# EAGLE schematic X15_PowerPlate.sch (EAGLE 9.7.0)

## Sheet 1 of 3: BRICKS SHEET
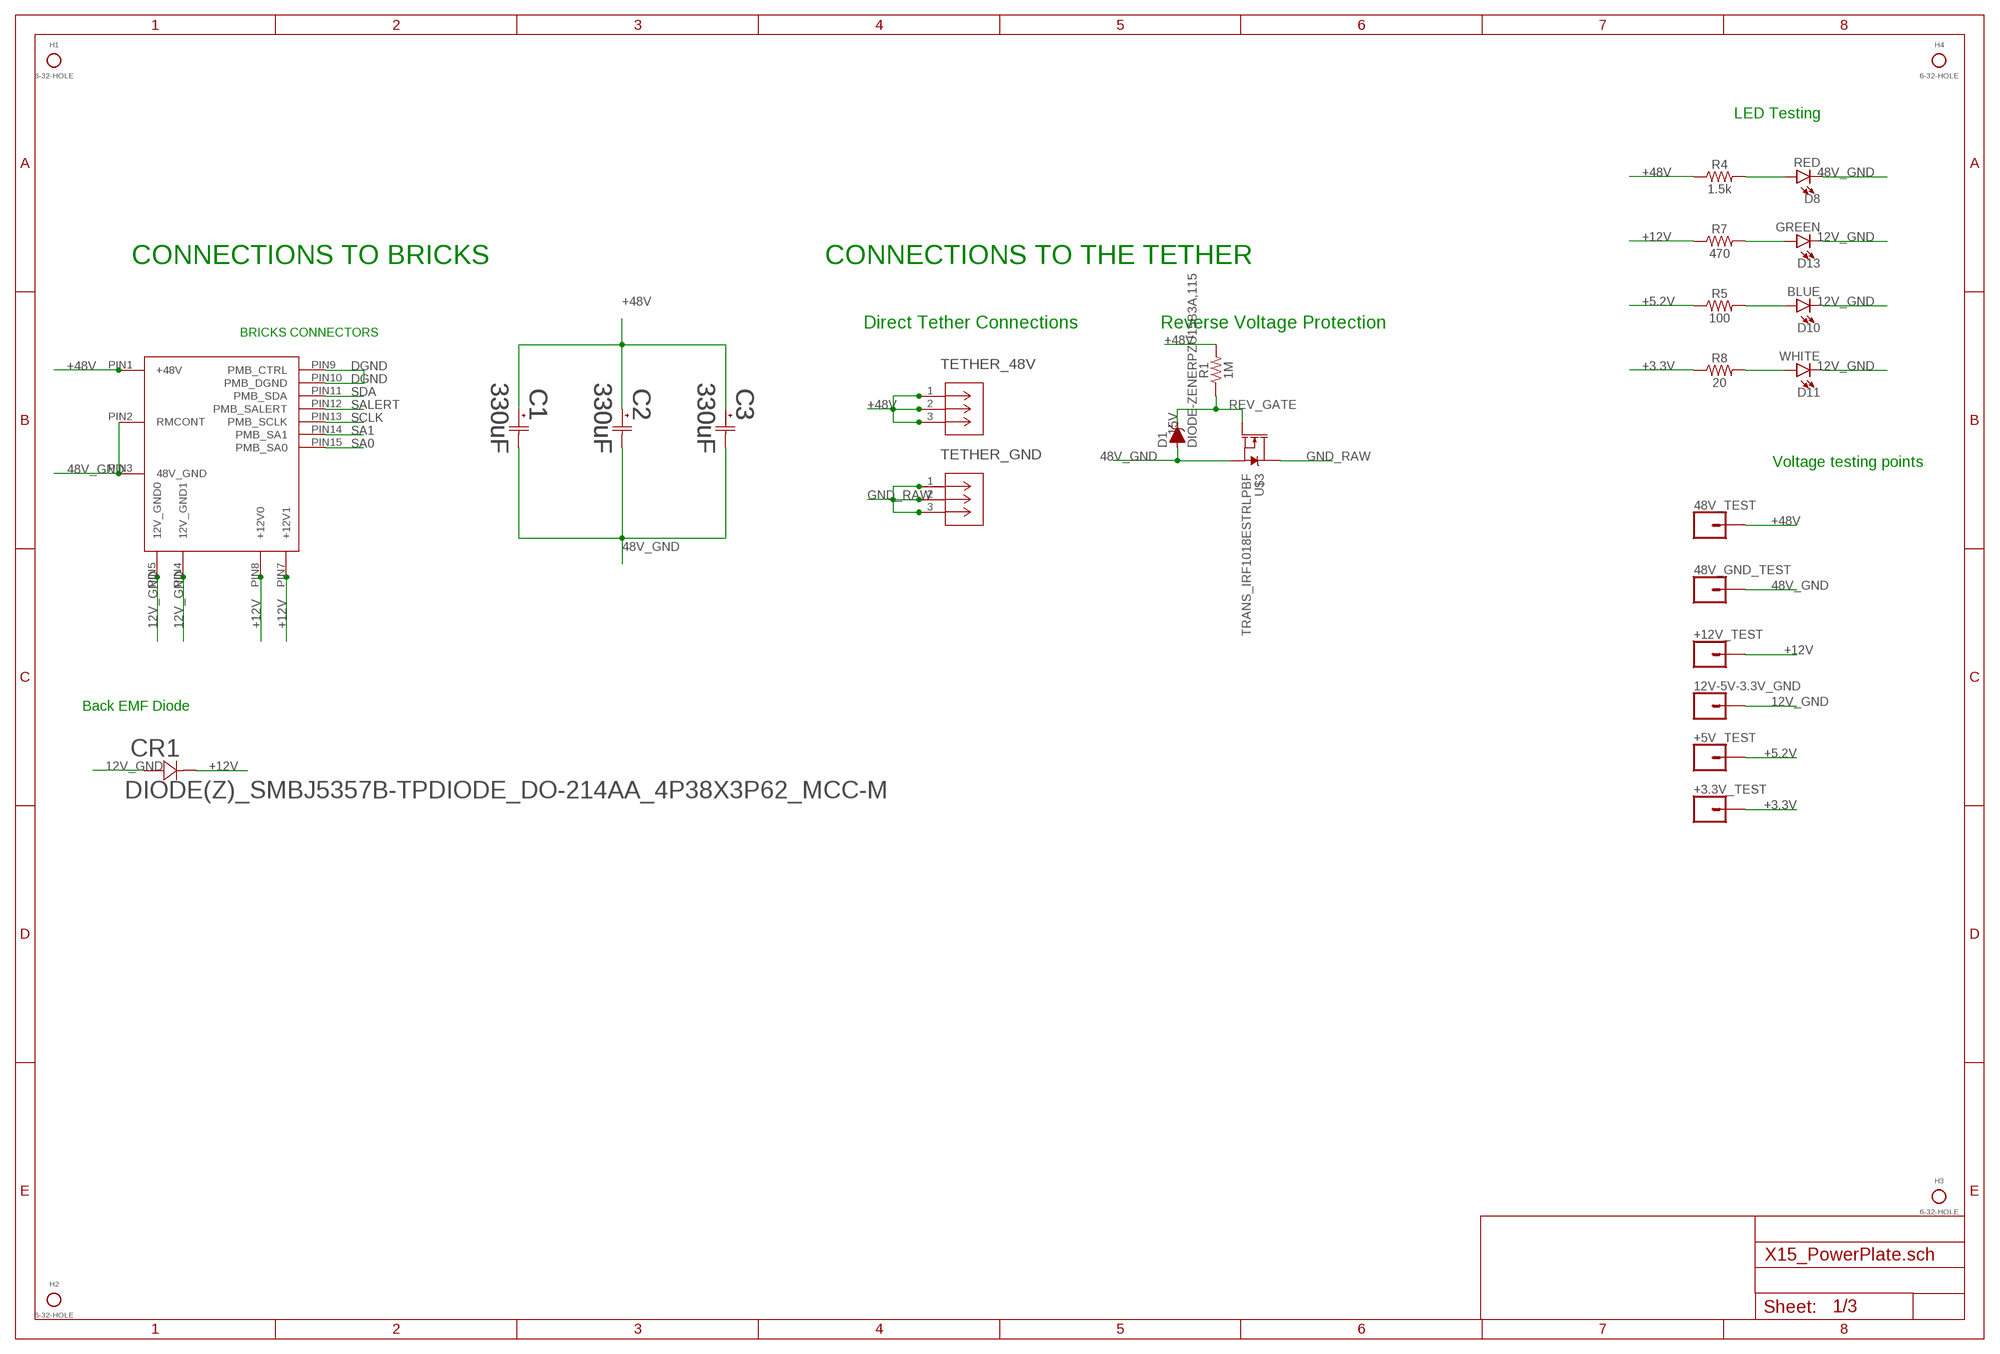
[diagram p0: schematic, sheet 1]

### Parts
12V-5V-3.3V_GND  CONN_01  [1X01]
48V_GND_TEST  CONN_01  [1X01]
48V_TEST  CONN_01  [1X01]
+3.3V_TEST  CONN_01  [1X01]
+5V_TEST  CONN_01  [1X01]
+12V_TEST  CONN_01  [1X01]
C1  330uF  CAP_MAL215099112E3CAP_099112E3_VIS-M  [CAP_099112E3_VIS-M]
C2  330uF  CAP_MAL215099112E3CAP_099112E3_VIS-M  [CAP_099112E3_VIS-M]
C3  330uF  CAP_MAL215099112E3CAP_099112E3_VIS-M  [CAP_099112E3_VIS-M]
CR1  DIODE(Z)_SMBJ5357B-TPDIODE_DO-214AA_4P38X3P62_MCC-M  [DIODE_DO-214AA_4P38X3P62_MCC-M]
D1  DIODE-ZENERPZU15B3A,115  [SOD-323]
D8  RED  LED-RED0603  [LED-0603]
D10  BLUE  LED-BLUE0603  [LED-0603]
D11  WHITE  LED-WHITE0603  [LED-0603]
D13  GREEN  LED-GREEN0603  [LED-0603]
H1  6-32-HOLE  [6-32-HOLE]
H2  6-32-HOLE  [6-32-HOLE]
H3  6-32-HOLE  [6-32-HOLE]
H4  6-32-HOLE  [6-32-HOLE]
R1  1M  1MOHM-0603-1/4W-5%  [0603]
R4  1.5k  1.5KOHM-0603-1/10W-1%  [0603]
R5  100  100OHM-0603-1/4W-5%  [0603]
R7  470  470OHM-0603-1/10W-1%  [0603]
R8  20  20OHM-0603-1/10W-1%  [0603]
TETHER_48V  796636-3(TETHER)  [CON3_P5MM_VER_TERM-BLK_TYC]
TETHER_GND  796636-3(TETHER)  [CON3_P5MM_VER_TERM-BLK_TYC]
U$2  CONN_BMR480_CONNECTOR(BRICK)  [BMR480_CONNECTOR]
U$3  TRANS_IRF1018ESTRLPBF  TRANS_IRF1018EPBF  [D2PAK]

### Nets
12V_GND: 12V-5V-3.3V_GND.1 CR1.2 D10.C D11.C D13.C U$2.PIN4(12V_GND1) U$2.PIN5(12V_GND0) ; also sheet 2,3
48V_GND: 48V_GND_TEST.1 C1.2 C2.2 C3.2 D1.A D8.C U$2.PIN2(RMCONT) U$2.PIN3(48V_GND) U$3.2(S)
+3.3V: +3.3V_TEST.1 R8.1 ; also sheet 2,3
+5.2V: +5V_TEST.1 R5.1 ; also sheet 2,3
+12V: +12V_TEST.1 CR1.1 R7.1 U$2.PIN7(+12V1) U$2.PIN8(+12V0) ; also sheet 2,3
+48V: 48V_TEST.1 C1.1 C2.1 C3.1 R1.2 R4.1 TETHER_48V.1 TETHER_48V.2 TETHER_48V.3 U$2.PIN1(+48V)
DGND: U$2.PIN9(PMB_CTRL) U$2.PIN10(PMB_DGND)
GND_RAW: TETHER_GND.1 TETHER_GND.2 TETHER_GND.3 U$3.3(D)
N$4: D8.A R4.2
N$9: D10.A R5.2
N$10: D11.A R8.2
N$13: D13.A R7.2
REV_GATE: D1.C R1.1 U$3.1(G)
SA0: U$2.PIN15(PMB_SA0)
SA1: U$2.PIN14(PMB_SA1)
SALERT: U$2.PIN12(PMB_SALERT)
SCLK: U$2.PIN13(PMB_SCLK)
SDA: U$2.PIN11(PMB_SDA)

### Notes on the sheet
- LED Testing
- CONNECTIONS TO BRICKS | CONNECTIONS TO THE TETHER
- Direct Tether Connections | Reverse Voltage Protection
- BRICKS CONNECTORS
- Voltage testing points
- Back EMF Diode

## Sheet 2 of 3: BACKPLANE SHEET
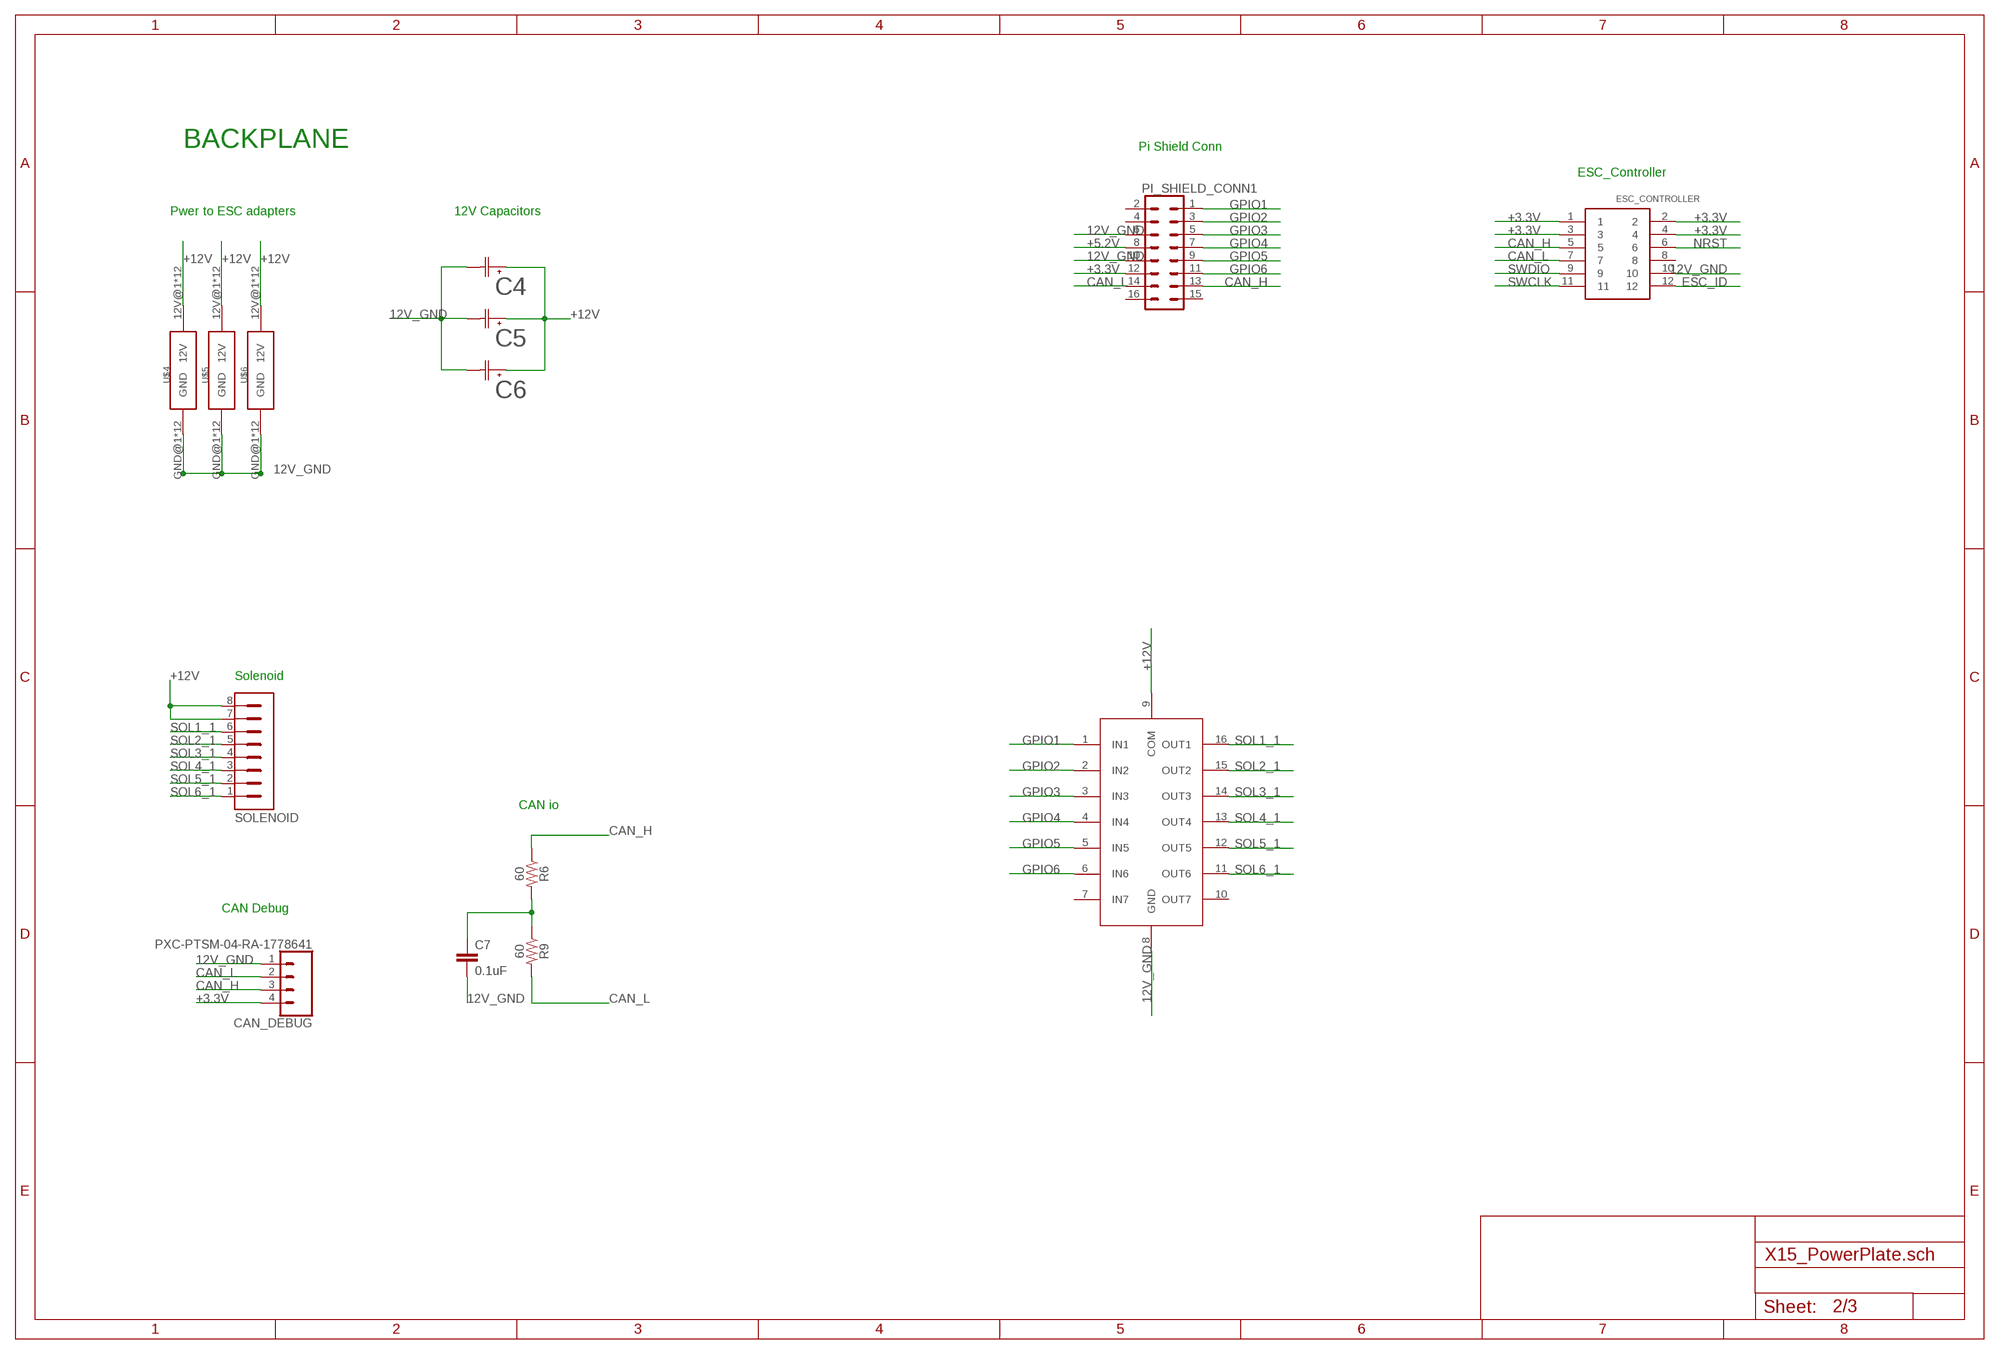
[diagram p1: schematic, sheet 2]

### Parts
C4  UCV1E561MNL1GSCAP_UCD_8X10_NCH  [CAP_UCD_8X10_NCH]
C5  UCV1E561MNL1GSCAP_UCD_8X10_NCH  [CAP_UCD_8X10_NCH]
C6  UCV1E561MNL1GSCAP_UCD_8X10_NCH  [CAP_UCD_8X10_NCH]
C7  0.1uF  0.1UF-0603-100V-10%  [0603]
CAN_DEBUG  PXC-PTSM-04-RA-1778641  [PXC-PTSM-04-RA-1778641]
ESC_CONTROLLER  BACKPLANE_CONNECTORSBKP  [BACKPLANE_CONNECTORS_BKP]
PI_SHIELD_CONN1  8X_CONN  [IPL7X2]
R6  60  RESISTOR0603  [0603]
R9  60  RESISTOR0603  [0603]
SOLENOID  PXC-8-RA-1778683  [PXC-8-RA-1778683]
U2  ULN2003AD  [16-SOIC]
U$4  BACKPLANE_ESC_ADAPTER_PWRBKP  [BACKPLANE_ESC_ADAPTER_BKP_PWR]
U$5  BACKPLANE_ESC_ADAPTER_PWRBKP  [BACKPLANE_ESC_ADAPTER_BKP_PWR]
U$6  BACKPLANE_ESC_ADAPTER_PWRBKP  [BACKPLANE_ESC_ADAPTER_BKP_PWR]

### Nets
12V_GND: C4.2 C5.2 C6.2 C7.2 CAN_DEBUG.1 ESC_CONTROLLER.10 PI_SHIELD_CONN1.6 PI_SHIELD_CONN1.10 U2.8(GND) U$4.GND@1(GND) U$4.GND@2(GND) U$4.GND@3(GND) U$4.GND@4(GND) U$4.GND@5(GND) U$4.GND@6(GND) U$4.GND@7(GND) U$4.GND@8(GND) U$4.GND@9(GND) U$4.GND@10(GND) U$4.GND@11(GND) U$4.GND@12(GND) U$5.GND@1(GND) U$5.GND@2(GND) U$5.GND@3(GND) U$5.GND@4(GND) U$5.GND@5(GND) U$5.GND@6(GND) U$5.GND@7(GND) U$5.GND@8(GND) U$5.GND@9(GND) U$5.GND@10(GND) U$5.GND@11(GND) U$5.GND@12(GND) U$6.GND@1(GND) U$6.GND@2(GND) U$6.GND@3(GND) U$6.GND@4(GND) U$6.GND@5(GND) U$6.GND@6(GND) U$6.GND@7(GND) U$6.GND@8(GND) U$6.GND@9(GND) U$6.GND@10(GND) U$6.GND@11(GND) U$6.GND@12(GND) ; also sheet 1,3
+3.3V: CAN_DEBUG.4 ESC_CONTROLLER.1 ESC_CONTROLLER.2 ESC_CONTROLLER.3 ESC_CONTROLLER.4 PI_SHIELD_CONN1.12 ; also sheet 1,3
+5.2V: PI_SHIELD_CONN1.8 ; also sheet 1,3
+12V: C4.1 C5.1 C6.1 SOLENOID.7 SOLENOID.8 U2.9(COM) U$4.12V@1(12V) U$4.12V@2(12V) U$4.12V@3(12V) U$4.12V@4(12V) U$4.12V@5(12V) U$4.12V@6(12V) U$4.12V@7(12V) U$4.12V@8(12V) U$4.12V@9(12V) U$4.12V@10(12V) U$4.12V@11(12V) U$4.12V@12(12V) U$5.12V@1(12V) U$5.12V@2(12V) U$5.12V@3(12V) U$5.12V@4(12V) U$5.12V@5(12V) U$5.12V@6(12V) U$5.12V@7(12V) U$5.12V@8(12V) U$5.12V@9(12V) U$5.12V@10(12V) U$5.12V@11(12V) U$5.12V@12(12V) U$6.12V@1(12V) U$6.12V@2(12V) U$6.12V@3(12V) U$6.12V@4(12V) U$6.12V@5(12V) U$6.12V@6(12V) U$6.12V@7(12V) U$6.12V@8(12V) U$6.12V@9(12V) U$6.12V@10(12V) U$6.12V@11(12V) U$6.12V@12(12V) ; also sheet 1,3
CAN_H: CAN_DEBUG.3 ESC_CONTROLLER.5 PI_SHIELD_CONN1.13 R6.1
CAN_L: CAN_DEBUG.2 ESC_CONTROLLER.7 PI_SHIELD_CONN1.14 R9.2
ESC_ID: ESC_CONTROLLER.12
GPIO1: PI_SHIELD_CONN1.1 U2.1(IN1)
GPIO2: PI_SHIELD_CONN1.3 U2.2(IN2)
GPIO3: PI_SHIELD_CONN1.5 U2.3(IN3)
GPIO4: PI_SHIELD_CONN1.7 U2.4(IN4)
GPIO5: PI_SHIELD_CONN1.9 U2.5(IN5)
GPIO6: PI_SHIELD_CONN1.11 U2.6(IN6)
N$1: C7.1 R6.2 R9.1
NRST: ESC_CONTROLLER.6
SOL1_1: SOLENOID.6 U2.16(OUT1)
SOL2_1: SOLENOID.5 U2.15(OUT2)
SOL3_1: SOLENOID.4 U2.14(OUT3)
SOL4_1: SOLENOID.3 U2.13(OUT4)
SOL5_1: SOLENOID.2 U2.12(OUT5)
SOL6_1: SOLENOID.1 U2.11(OUT6)
SWCLK: ESC_CONTROLLER.11
SWDIO: ESC_CONTROLLER.9
Unconnected: ESC_CONTROLLER.8 PI_SHIELD_CONN1.2 PI_SHIELD_CONN1.4 PI_SHIELD_CONN1.15 PI_SHIELD_CONN1.16 U2.7(IN7) U2.10(OUT7)

### Notes on the sheet
- BACKPLANE | Pi Shield Conn
- ESC_Controller
- Pwer to ESC adapters | 12V Capacitors
- Solenoid
- CAN io
- CAN Debug

## Sheet 3 of 3: POWER CONVERSION
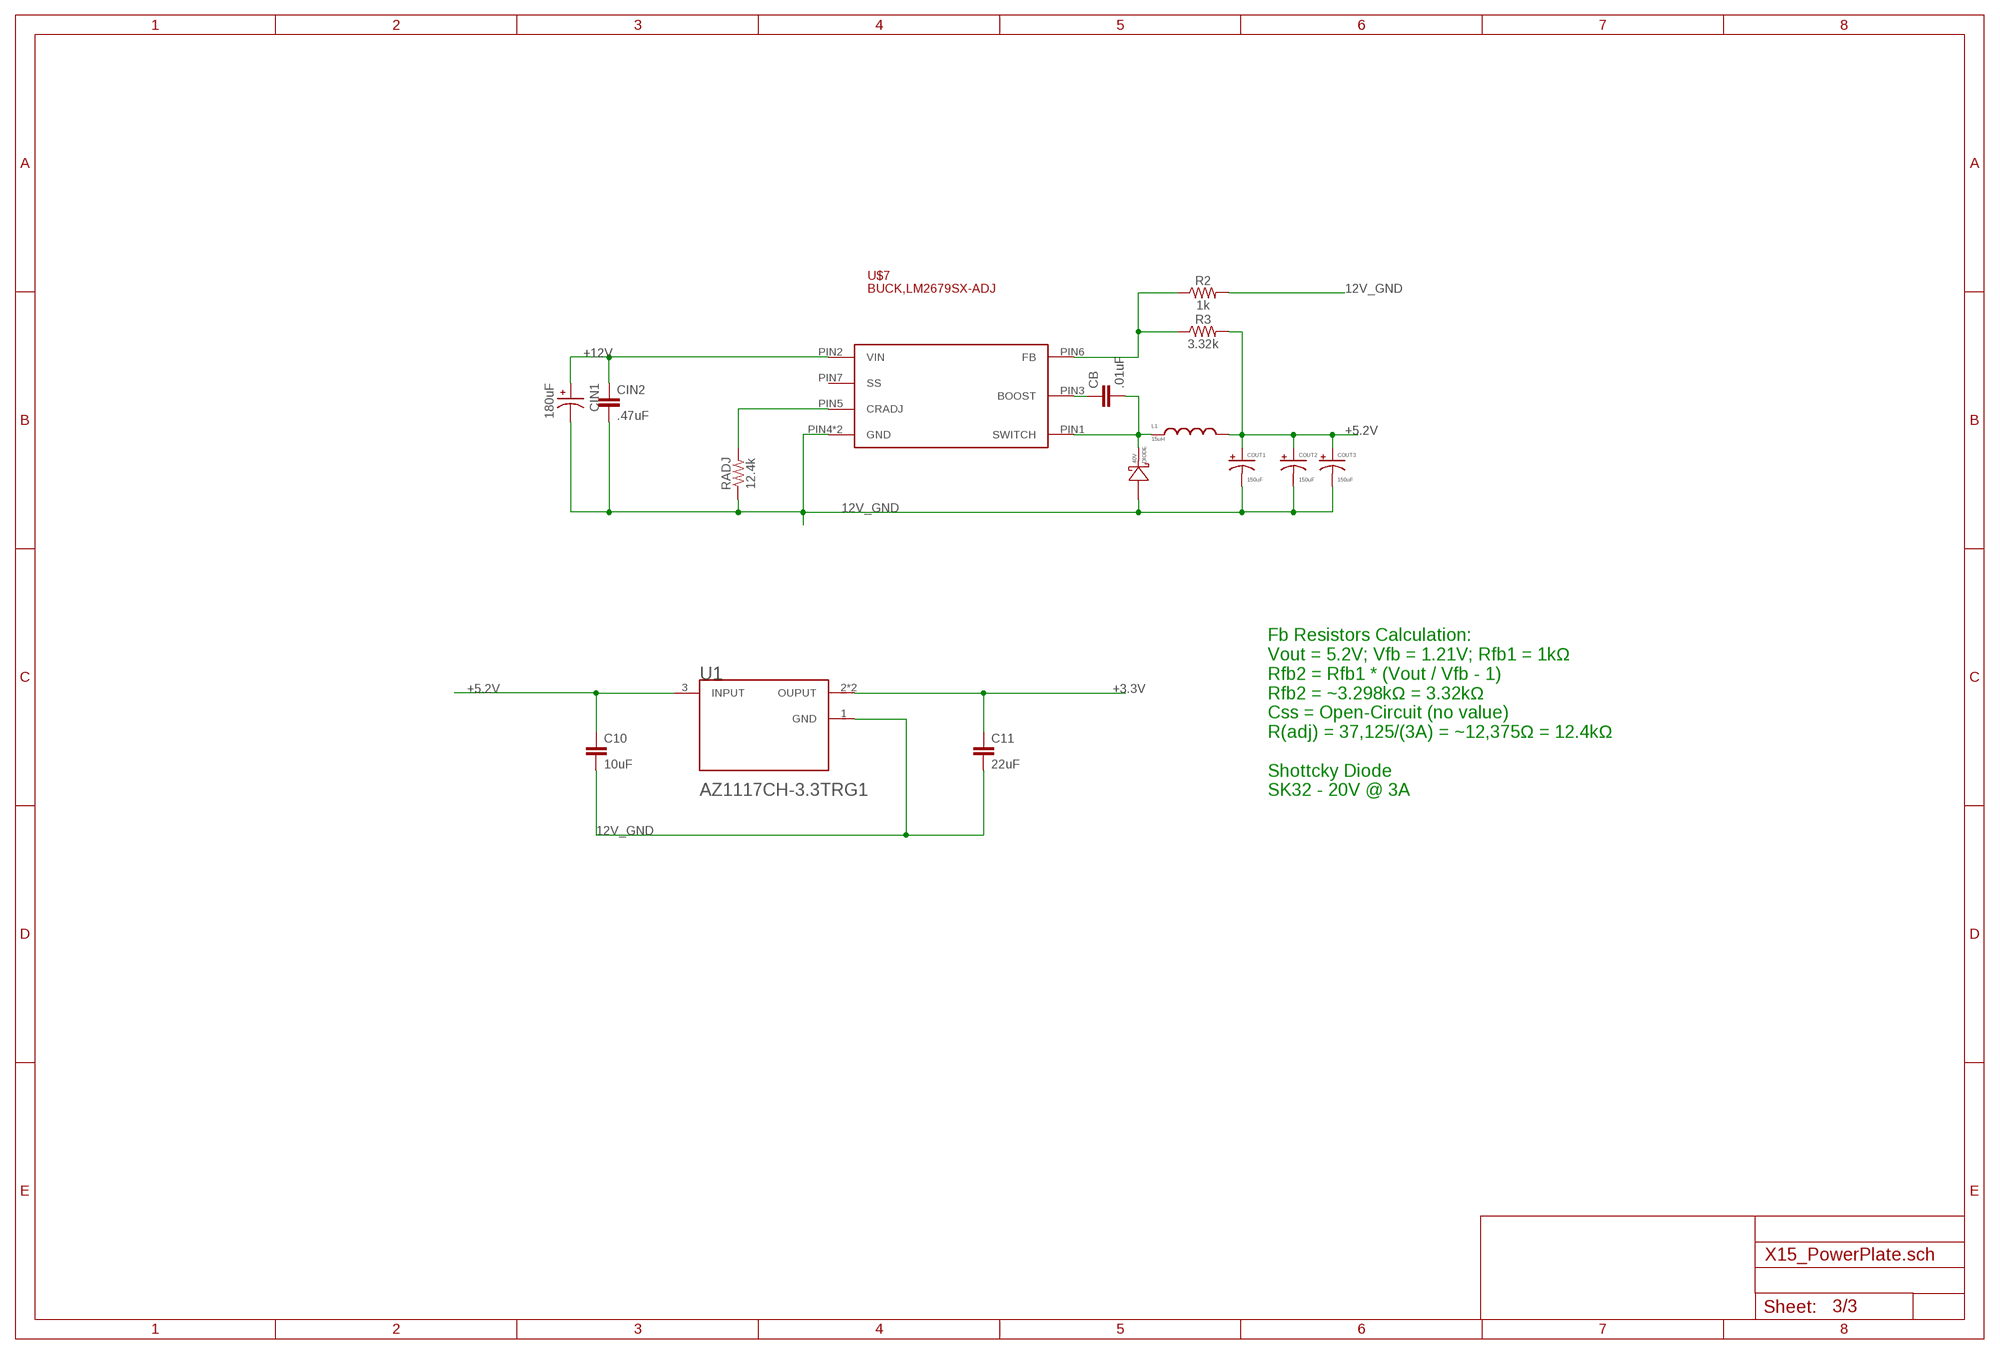
[diagram p2: schematic, sheet 3]

### Parts
C10  10uF  4.7PF-0603-50V-5%  [0603]
C11  22uF  4.7PF-0603-50V-5%  [0603]
CB  .01uF  4.7PF-0603-50V-5%  [0603]
CIN1  180uF  EEEFKE181XSP  [CAP_EEEFKE181XSP]
CIN2  .47uF  4.7PF-0603-50V-5%  [0603]
COUT1  150uF  C-TANTALUM(10UF_150UF)  [2917(7343-31-METRIC)]
COUT2  150uF  C-TANTALUM(10UF_150UF)  [2917(7343-31-METRIC)]
COUT3  150uF  C-TANTALUM(10UF_150UF)  [2917(7343-31-METRIC)]
DIODE  40V  CDBG520-G  [DO214AC]
L1  15uH  HCMA1305  [HCMA1305]
R2  1k  2.0KOHM-0603-1/10W-5%  [0603]
R3  3.32k  2.0KOHM-0603-1/10W-5%  [0603]
RADJ  12.4k  2.0KOHM-0603-1/10W-5%  [0603]
U1  LINEAR,AZ1117CR-3.3TRG1DIODES_AZ1117CH-3.3TRG1_0_0  [LINEAR,AZ1117CR-3.3TRG1]
U$7  BUCK,LM2679SX-ADJ  [BUCK,LM2679SX-ADJ]

### Nets
12V_GND: C10.2 C11.2 CIN1.2 CIN2.2 COUT1.- COUT2.- COUT3.- DIODE.A R2.2 RADJ.1 U1.1(GND) U$7.PIN4(GND) U$7.PIN8(GND) ; also sheet 1,2
+3.3V: C11.1 U1.2(OUPUT) U1.4(OUPUT) ; also sheet 1,2
+5.2V: C10.1 COUT1.+ COUT2.+ COUT3.+ L1.2 R3.2 U1.3(INPUT) ; also sheet 1,2
+12V: CIN1.1 CIN2.1 U$7.PIN2(VIN) ; also sheet 1,2
BOOST: CB.1 U$7.PIN3(BOOST)
CRADJ: RADJ.2 U$7.PIN5(CRADJ)
FB: R2.1 R3.1 U$7.PIN6(FB)
SWITCH: CB.2 DIODE.C L1.1 U$7.PIN1(SWITCH)
Unconnected: U$7.PIN7(SS)

### Notes on the sheet
- Fb Resistors Calculation: 
  Vout = 5.2V; Vfb = 1.21V; Rfb1 = 1kΩ 
  Rfb2 = Rfb1 * (Vout / Vfb - 1) 
  Rfb2 = ~3.298kΩ = 3.32kΩ
  Css = Open-Circuit (no value)
  R(adj) = 37,125/(3A) = ~12,375Ω = 12.4kΩ
  
  Shottcky Diode
  SK32 - 20V @ 3A

## Library data of the parts
12V-5V-3.3V_GND 48V_GND_TEST 48V_TEST +3.3V_TEST +5V_TEST +12V_TEST = SparkFun-Connectors:CONN_01: Single connection point. Often used as Generic Header-pin footprint for 0.1 inch spaced/style header connections On any of the 0.1 inch spaced packages, you can populate with these: Break Away Headers - Straight <https://www.sparkfun.com/products/116> (PRT-00116) Break Away Male Headers - Right Angle <https://www.sparkfun.com/products/553> (PRT-00553) Female Headers <https://www.sparkfun.com/products/115> (PRT-00115) Break Away Headers - Machine Pin <https://www.sparkfun.com/products/117> (PRT-00117) Break Away Female Headers - Swiss Machine Pin <https://www.sparkfun.com/products/743> (PRT-00743) This device is also useful as a general connection point to wire up your design to another part of your project. Our various solder wires solder well into these plated through hole pads. Hook-Up Wire - Assortment (Stranded, 22 AWG) <https://www.sparkfun.com/products/11375> (PRT-11375) Hook-Up Wire - Assortment (Solid Core, 22 AWG) <https://www.sparkfun.com/products/11367> (PRT-11367) View the entire wire category on our website here <https://www.sparkfun.com/categories/141> Special notes: SMTSO-256-ET is a "flush mount" nut for a 4-40 screw. We mostly use this on specialty testbeds; it is a nice way to connect hardware to your PCB at an adjustable hieght. Also note, the SNAP packages are for using a snappable style connector. We sell a baggie of snaps and they are also used on two LilyPad designs: Snap Assortment - 30 pack (male and female) <https://www.sparkfun.com/products/11347> (DEV-11347) LilyPad Arduino SimpleSnap <https://www.sparkfun.com/products/10941> (DEV-10941) LilyPad SimpleSnap Protoboard <https://www.sparkfun.com/products/10940> (DEV-10940)
C1-C3 = X15_Brickstribution:CAP_MAL215099112E3; COPYRIGHT: Copyright (C) 2022 Ultra Librarian. All rights reserved.; MANUFACTURER_PART_NUMBER: MAL215099112E3; MFR_NAME: Vishay
C4-C6 = 2023-01-03_19-29-37_Library:UCV1E561MNL1GS; COPYRIGHT: Copyright (C) 2023 Ultra Librarian. All rights reserved.; DIGI-KEY_PART_NUMBER_1: 493-14353-1-ND; DIGI-KEY_PART_NUMBER_2: 493-14353-2-ND; DIGI-KEY_PART_NUMBER_3: 493-14353-6-ND; MANUFACTURER_PART_NUMBER: UCV1E561MNL1GS; MFR_NAME: Nichicon
C7 = SparkFun-Capacitors:0.1UF: 0.1µF ceramic capacitors A capacitor is a passive two-terminal electrical component used to store electrical energy temporarily in an electric field.; PROD_ID: CAP-08390
C10 C11 CB CIN2 = SparkFun-Capacitors:4.7PF: 4.7pF ceramic capacitors A capacitor is a passive two-terminal electrical component used to store electrical energy temporarily in an electric field.; PROD_ID: CAP-07880; VALUE: 4.7pF
CAN_DEBUG = X15-Backplane Parts:PXC-PTSM-04-RA-1778641
CIN1 = X15-Conversion-Parts-Library:EEEFKE181XSP; DESCRIPTION: 180µF 25V Aluminum Electrolytic Capacitors Radial, Can - SMD 340mOhm @ 100kHz 2000 Hrs @ 105°C; DIGI-KEY_PART_NUMBER: P18956TR-ND; MF: Panasonic; MP: EEEFKE181XSP; PACKAGE: RADIAL-2 Panasonic
COUT1-COUT3 = X15-Conversion-Parts-Library:C-TANTALUM(10UF_150UF)
CR1 = X15_Brickstribution:DIODE(Z)_SMBJ5357B-TP; COPYRIGHT: Copyright (C) 2022 Ultra Librarian. All rights reserved.; MANUFACTURER_PART_NUMBER: SMBJ5357B-TP; MFR_NAME: MCC
D1 = SparkFun-DiscreteSemi:DIODE-ZENER: Zener Diode A Zener diode allows current to flow from its anode to its cathode like a normal semiconductor diode, but it also permits current to flow in the reverse direction when its "Zener voltage" is reached. - WIkipedia; ZENER_VOLTAGE: 15V
D8 = SparkFun-LED:LED-RED: Red SMD LED Used in manufacturing of most products at SparkFun Packages: 0603 - SMD 0603 package [Product Link] <http://docs.avagotech.com/docs/AV02-0551EN> 0603 SMART - SMD 0603 SMART package ( more efficient and expensive)[Product Link] <http://www.osram-os.com/Graphics/XPic2/00077099_0.pdf> 1206 - SMD1206 package [Product Link] <https://www.sparkfun.com/datasheets/DevTools/LilyPad/Q150OVS4.pdff> SparkFun Products: Pro Mini 328 -5V <https://www.sparkfun.com/products/821> RedBoard <https://www.sparkfun.com/products/12757> IOIO-OTG <https://www.sparkfun.com/products/13613>; PROD_ID: DIO-00819
D10 = SparkFun-LED:LED-BLUE: Blue SMD LED Used in manufacturing of various products at SparkFun Packages: 0603 - SMD 0603 package [Product Link] <http://www.digikey.com/product-detail/en/SMLE12BC7TT86/511-1589-2-ND/1641808> 1206 - SMD1206 package [Product Link] <http://www.digikey.com/product-detail/en/lite-on-inc/LTST-C150TBKT/160-1643-1-ND/573584> SparkFun Products: ESP8266 Thing-Dev Board <https://www.sparkfun.com/products/13711> RedBoard <https://www.sparkfun.com/products/12757>; PROD_ID: DIO-08575
D11 = SparkFun-LED:LED-WHITE: White SMD LED Used in manufacturing several products at SparkFun. Packages: 0603 - Bright White SMD 0603 package[Product Link] <http://www.kingbrightusa.com/product.asp?catalog_name=LED&product_id=APT1608QWF/D> 1206 - Bright White SMD1206 package [Product Link] <http://www.kingbrightusa.com/product.asp?catalog_name=LED&product_id=APT3216QWF/D> 3014 - Super Bright SMD 3014 package [Datasheet] <http://www.lumileds.com/uploads/459/DS208-pdf> SparkFun Products: Blackberry Trackballer Breakout <https://www.sparkfun.com/products/13169> Digital SandBox <https://www.sparkfun.com/products/12651>; PROD_ID: DIO-09004
D13 = SparkFun-LED:LED-GREEN: Green SMD LED Used in manufacturing of various products at SparkFun Packages: 0603 - SMD 0603 package [Product Link] <http://www.futureelectronics.com/en/technologies/semiconductors/optoelectronics/leds/Pages/9894312-LTST-C190GKT.aspx?CrossPart=HSMG-C190&IM=0> LilyPad 1206 - SMD1206 LilyPad package [Product Link] <http://www.futureelectronics.com/en/Technologies/Product.aspx?ProductID=IN150NGHARVATEKCORPORATION2049943&IM=0> 1206 - SMD1206 package [Product Link] <http://www.futureelectronics.com/en/technologies/semiconductors/optoelectronics/leds/Pages/8315665-LTST-C150KGKT.aspx?IM=0> 1206 Bottom Mount -SMD 1206 Bottom Mount [Product Link] <http://www.digikey.com/product-detail/en/lite-on-inc/LTST-C230KGKT/160-1456-1-ND/386854> SparkFun Products: Pro Mini 328 -5V <https://www.sparkfun.com/products/821> RedBoard <https://www.sparkfun.com/products/12757> MP3 Trigger <https://www.sparkfun.com/products/13720> Makey Makey <https://www.sparkfun.com/products/11076>; PROD_ID: DIO-00821
DIODE = X15-Conversion-Parts-Library:CDBG520-G
ESC_CONTROLLER = X15-Backplane Parts:BACKPLANE_CONNECTORS: Use samtec TMM and MMS
H1-H4 = X15_Brickstribution:6-32-HOLE
L1 = X15-Conversion-Parts-Library:HCMA1305: Eaton HCMA1305-150-R Inductor
PI_SHIELD_CONN1 = X15-Backplane Parts:8X_CONN
R1 = SparkFun-Resistors:1MOHM: 1MΩ resistor A resistor is a passive two-terminal electrical component that implements electrical resistance as a circuit element. Resistors act to reduce current flow, and, at the same time, act to lower voltage levels within circuits. - Wikipedia; PROD_ID: RES-07868
R2 R3 RADJ = SparkFun-Resistors:2.0KOHM: 2kΩ resistor A resistor is a passive two-terminal electrical component that implements electrical resistance as a circuit element. Resistors act to reduce current flow, and, at the same time, act to lower voltage levels within circuits. - Wikipedia; PROD_ID: RES-08296; VALUE: 2.0k
R4 = SparkFun-Resistors:1.5KOHM: 1.5kΩ resistor A resistor is a passive two-terminal electrical component that implements electrical resistance as a circuit element. Resistors act to reduce current flow, and, at the same time, act to lower voltage levels within circuits. - Wikipedia; PROD_ID: RES-08306
R5 = SparkFun-Resistors:100OHM: 100Ω resistor A resistor is a passive two-terminal electrical component that implements electrical resistance as a circuit element. Resistors act to reduce current flow, and, at the same time, act to lower voltage levels within circuits. - Wikipedia; PROD_ID: RES-12438
R6 R9 = SparkFun-Resistors:RESISTOR: Generic Resistor Package
R7 = SparkFun-Resistors:470OHM: 470Ω resistor A resistor is a passive two-terminal electrical component that implements electrical resistance as a circuit element. Resistors act to reduce current flow, and, at the same time, act to lower voltage levels within circuits. - Wikipedia; PROD_ID: RES-07869
R8 = SparkFun-Resistors:20OHM: RES-07862; PROD_ID: RES-07862
SOLENOID = X15-Backplane Parts:PXC-8-RA-1778683; SPICEPREFIX: X
TETHER_48V TETHER_GND = X15_Brickstribution:796636-3(TETHER); COPYRIGHT: Copyright (C) 2022 Ultra Librarian. All rights reserved.; DIGI-KEY_PART_NUMBER_1: A98423-ND; MANUFACTURER_PART_NUMBER: 796636-3; MFR_NAME: TE Connectivity
U1 = X15-Conversion-Parts-Library:LINEAR,AZ1117CR-3.3TRG1: 1.35A 3.3V LDO Reg. Current Limit SOT223 Check availability <https://pricing.snapeda.com/parts/AZ1117CH-3.3TRG1/Diodes%20Inc./view-part?ref=eda>; AVAILABILITY: In Stock; DESCRIPTION: Linear Voltage Regulator IC Positive Fixed 1 Output 1A SOT-223-3; MF: Diodes Inc.; MP: AZ1117CH-3.3TRG1; PACKAGE: SOT-223 Diodes Inc.; PRICE: None; PURCHASE-URL: https://pricing.snapeda.com/search/part/AZ1117CH-3.3TRG1/?ref=eda
U2 = X15-Pi-Shield-Parts:ULN2003AD; A1_MIN: 0.25; A_MAX: 1.75; A_MIN: 1.75; A_NOM: 1.75; B_MAX: 0.51; B_MIN: 0.33; B_NOM: 0.42; D2_MAX: 0.0; D_MAX: 10.0; D_MIN: 9.8; D_NOM: 9.9; E1_MAX: 4.0; E1_MIN: 3.8; E1_NOM: 3.9; E2_MAX: 0.0; ENOM: 1.27; E_MAX: 6.2; E_MIN: 5.8; E_NOM: 6.0; L_MAX: 1.27; L_MIN: 0.38; L_NOM: 0.825; MANUFACTURER: Diodes Inc.; PIN_COUNT: 16.0; SNAPEDA_PACKAGE_ID: 27538; STANDARD: IPC 7351B
U$2 = X15-Parts_Bricktribution:CONN_BMR480_CONNECTOR(BRICK)
U$3 = X15_Brickstribution:TRANS_IRF1018EPBF
U$4-U$6 = X15-Backplane Parts:BACKPLANE_ESC_ADAPTER_PWR
U$7 = X15-Conversion-Parts-Library:BUCK,LM2679SX-ADJ